# EAGLE schematic bbshd (EAGLE 7.5.0)

## Sheet 1 of 2
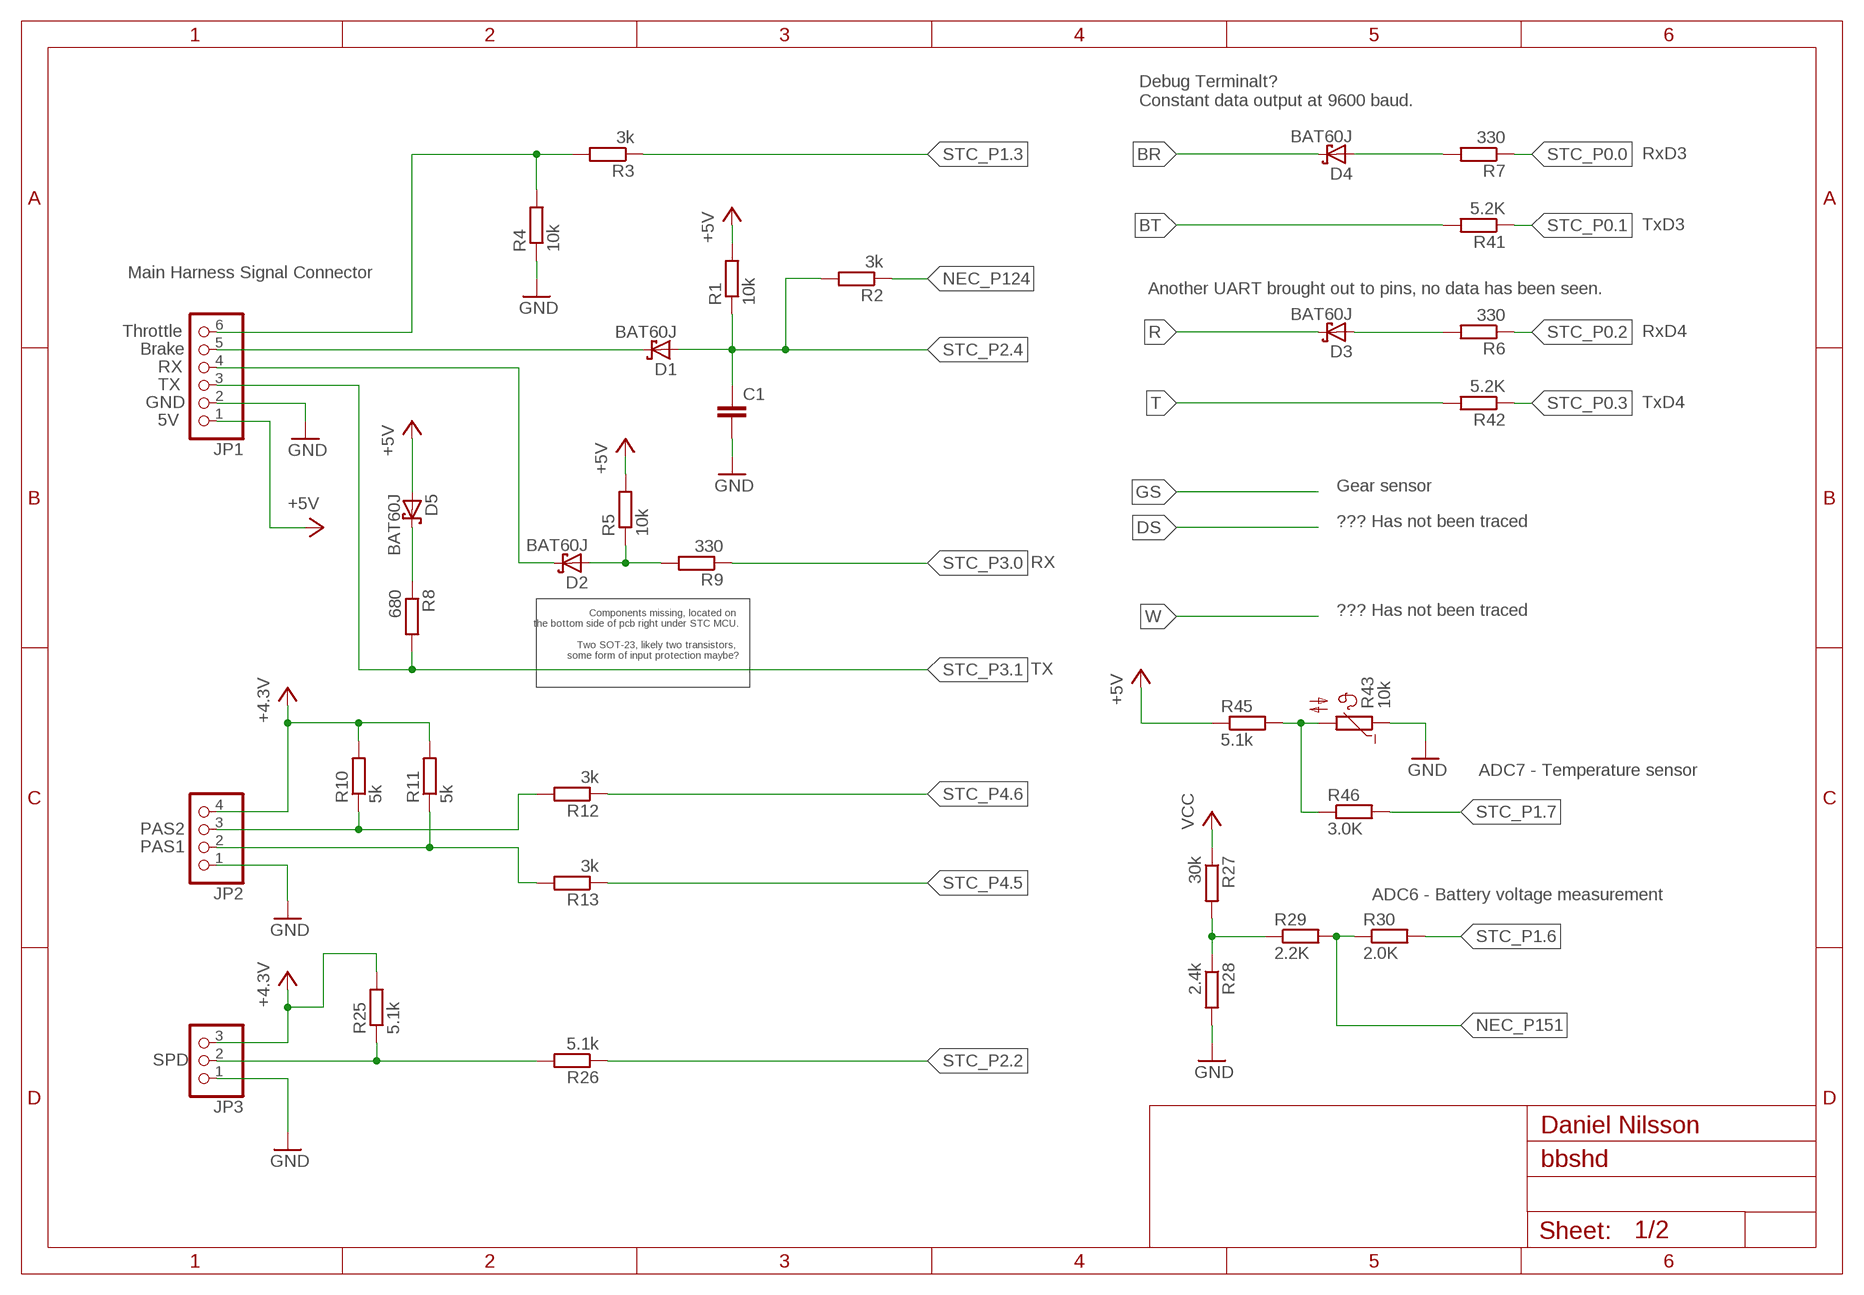
[diagram p0: schematic, sheet 1]

### Parts
C1  C-EUC0603  [C0603]
D1  BAT60J  [SOD323_ST]
D2  BAT60J  [SOD323_ST]
D3  BAT60J  [SOD323_ST]
D4  BAT60J  [SOD323_ST]
D5  BAT60J  [SOD323_ST]
JP1  PINHD-1X6  [1X06]
JP2  PINHD-1X4  [1X04]
JP3  PINHD-1X3  [1X03]
R1  10k  R-EU_R0603  [R0603]
R2  3k  R-EU_R0603  [R0603]
R3  3k  R-EU_R0603  [R0603]
R4  10k  R-EU_R0603  [R0603]
R5  10k  R-EU_R0603  [R0603]
R6  330  R-EU_R0603  [R0603]
R7  330  R-EU_R0603  [R0603]
R8  680  R-EU_R0603  [R0603]
R9  330  R-EU_R0603  [R0603]
R10  5k  R-EU_R0603  [R0603]
R11  5k  R-EU_R0603  [R0603]
R12  3k  R-EU_R0603  [R0603]
R13  3k  R-EU_R0603  [R0603]
R25  5.1k  R-EU_R0603  [R0603]
R26  5.1k  R-EU_R0603  [R0603]
R27  30k  R-EU_R0603  [R0603]
R28  2.4k  R-EU_R0603  [R0603]
R29  2.2K  R-EU_R0603  [R0603]
R30  2.0K  R-EU_R0603  [R0603]
R41  5.2K  R-EU_R0603  [R0603]
R42  5.2K  R-EU_R0603  [R0603]
R43  10k  NTC640  [P640]
R45  5.1k  R-EU_R0603  [R0603]
R46  3.0K  R-EU_R0603  [R0603]

### Nets
+3V3: JP2.4 JP3.3 R10.2 R11.2 R25.2 ; supply symbol labelled +4.3V ; also sheet 2
+5V: D5.A JP1.1 R1.2 R5.2 R45.1 ; also sheet 2
BR: D4.C
BT: R41.2
GND: C1.2 JP1.2 JP2.1 JP3.1 R4.1 R28.2 R43.1 ; also sheet 2
N$1: JP1.6 R3.2 R4.2
N$2: D1.C JP1.5
N$3: D2.C JP1.4
N$4: D2.A R5.1 R9.2
N$5: D3.A R6.2
N$6: D4.A R7.2
N$7: JP2.2 R11.1 R13.2
N$8: D5.C R8.1
N$9: JP2.3 R10.1 R12.2
N$10: JP3.2 R25.1 R26.2
N$14: R27.2 R28.1 R29.1
N$21: R43.2 R45.2 R46.1
NEC_P124: R2.1
NEC_P151: R29.2 R30.1
R: D3.C
STC_P0.0: R7.1
STC_P0.1: R41.1
STC_P0.2: R6.1
STC_P0.3: R42.1
STC_P1.3: R3.1
STC_P1.6: R30.2
STC_P1.7: R46.2
STC_P2.2: R26.1
STC_P2.4: C1.1 D1.A R1.1 R2.2
STC_P3.0: R9.1
STC_P3.1: JP1.3 R8.2
STC_P4.5: R13.1
STC_P4.6: R12.1
T: R42.2
VCC: R27.1

### Notes on the sheet
- Debug Terminalt?
  Constant data output at 9600 baud.
- RxD3
- TxD3
- Main Harness Signal Connector
- Another UART brought out to pins, no data has been seen.
- Throttle | RxD4
- Brake
- RX
- TX
- GND | TxD4
- 5V
- Gear sensor
- ??? Has not been traced
- RX
- Components missing, located on 
  the bottom side of pcb right under STC MCU.
  
  Two SOT-23, likely two transistors, 
  some form of input protection maybe?
- ??? Has not been traced
- TX
- ADC7 - Temperature sensor
- PAS2
- PAS1
- ADC6 - Battery voltage measurement
- SPD
- Daniel Nilsson

## Sheet 2 of 2
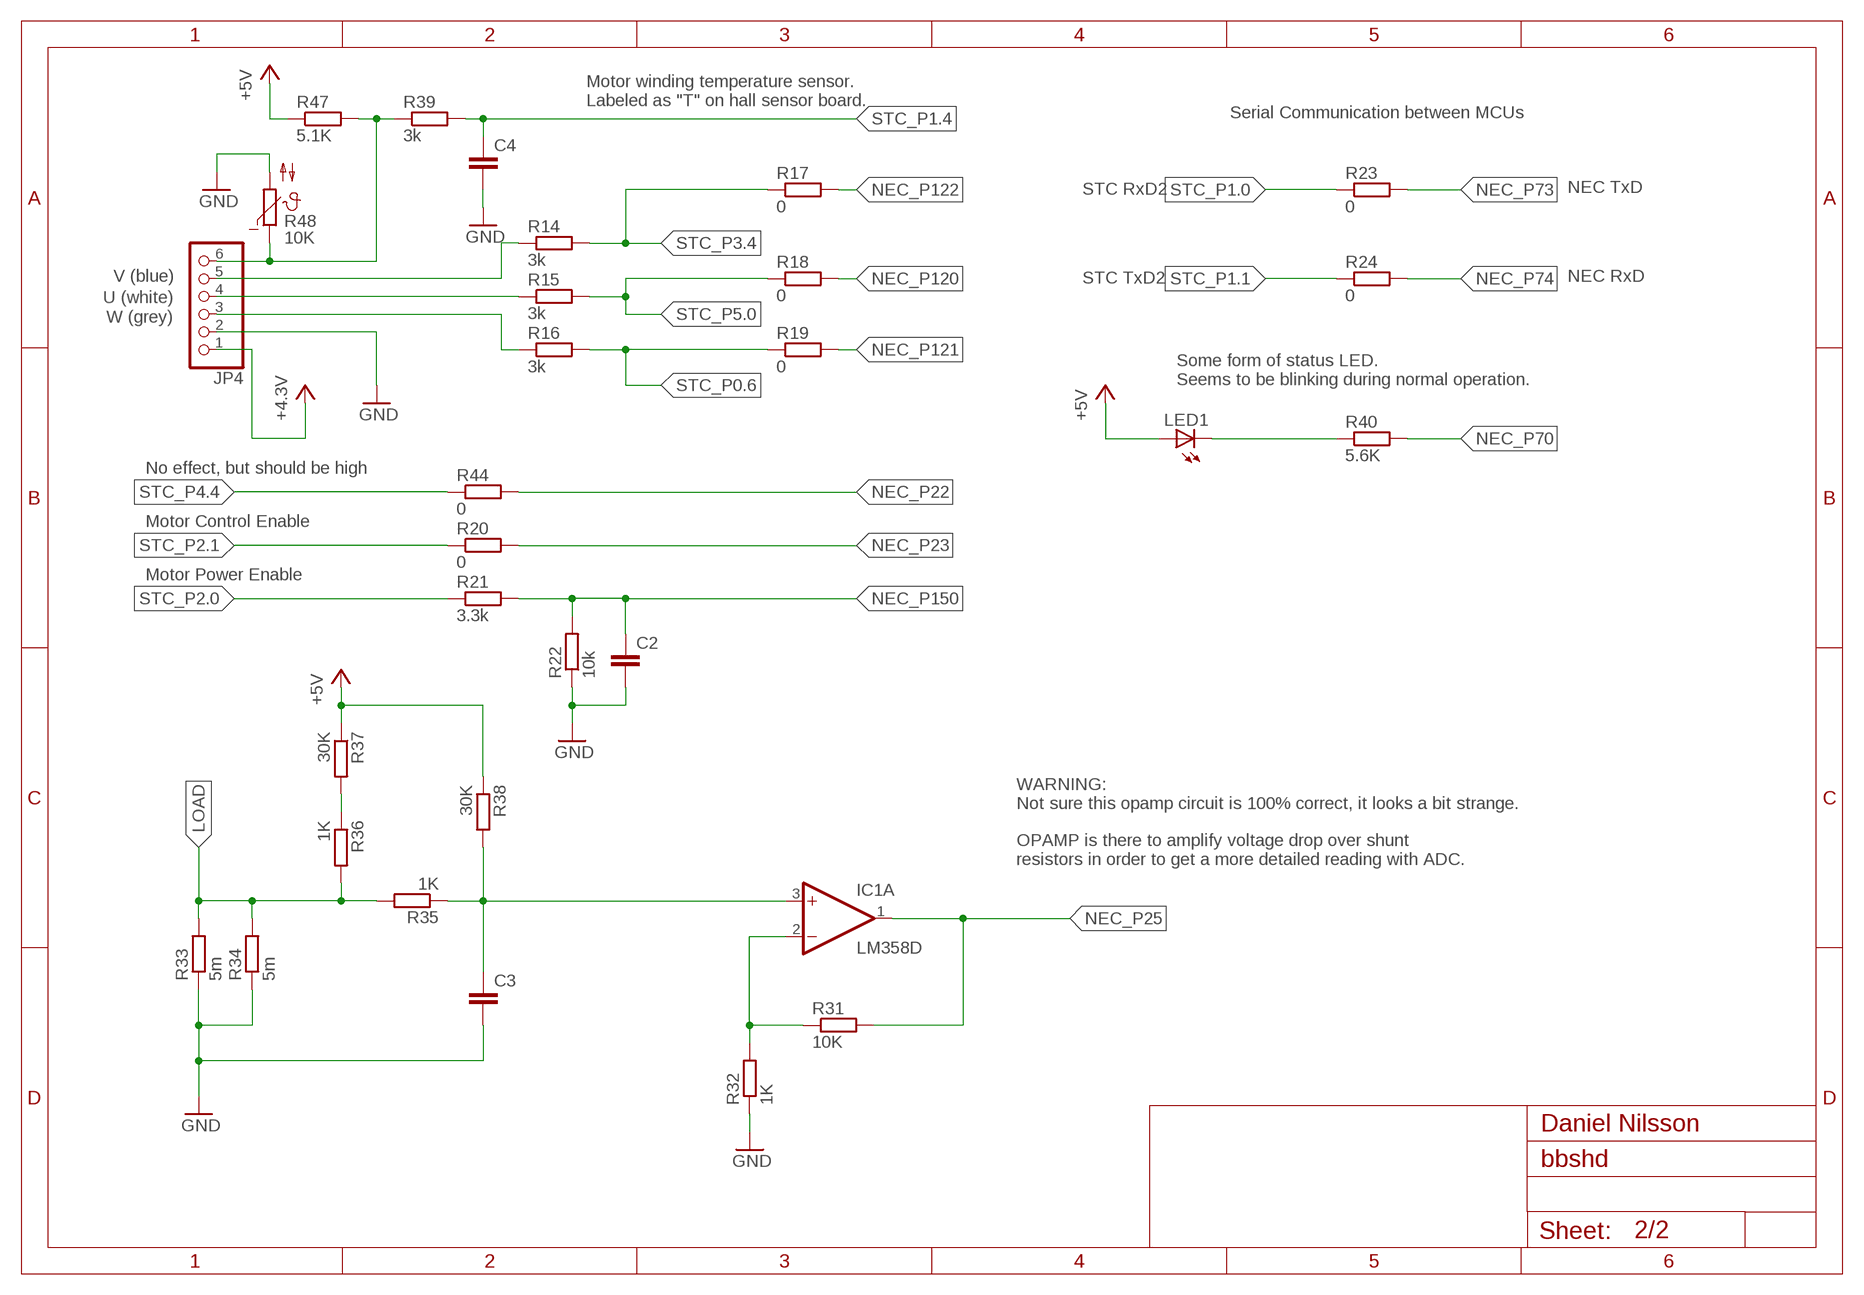
[diagram p1: schematic, sheet 2]

### Parts
C2  C-EUC0603  [C0603]
C3  C-EUC0603  [C0603]
C4  C-EUC0603  [C0603]
IC1  LM358D  [SO08]
JP4  PINHD-1X6  [1X06]
LED1  LED  [SMARTLED-TTW]
R14  3k  R-EU_R0603  [R0603]
R15  3k  R-EU_R0603  [R0603]
R16  3k  R-EU_R0603  [R0603]
R17  0  R-EU_R0603  [R0603]
R18  0  R-EU_R0603  [R0603]
R19  0  R-EU_R0603  [R0603]
R20  0  R-EU_R0603  [R0603]
R21  3.3k  R-EU_R0603  [R0603]
R22  10k  R-EU_R0603  [R0603]
R23  0  R-EU_R0603  [R0603]
R24  0  R-EU_R0603  [R0603]
R31  10K  R-EU_R0603  [R0603]
R32  1K  R-EU_R0603  [R0603]
R33  5m  R-EU_R0603  [R0603]
R34  5m  R-EU_R0603  [R0603]
R35  1K  R-EU_R0603  [R0603]
R36  1K  R-EU_R0603  [R0603]
R37  30K  R-EU_R0603  [R0603]
R38  30K  R-EU_R0603  [R0603]
R39  3k  R-EU_R0603  [R0603]
R40  5.6K  R-EU_R0603  [R0603]
R44  0  R-EU_R0603  [R0603]
R47  5.1K  R-EU_R0603  [R0603]
R48  10K  NTC642-6  [P642]

### Nets
+3V3: JP4.1 ; supply symbol labelled +4.3V ; also sheet 1
+5V: LED1.A@1(A) R37.1 R38.1 R47.1 ; also sheet 1
GND: C2.2 C3.2 C4.2 JP4.2 R22.1 R32.1 R33.1 R34.1 R48.2 ; also sheet 1
LOAD: R33.2 R34.2 R35.2 R36.2
N$11: JP4.3 R16.1
N$12: JP4.4 R15.1
N$13: JP4.5 R14.1
N$16: JP4.6 R39.1 R47.2 R48.1
N$17: IC1.2(A:-IN) R31.1 R32.2
N$18: R36.1 R37.2
N$19: C3.1 IC1.3(A:+IN) R35.1 R38.2
N$20: LED1.C@1(C) R40.1
NEC_P22: R44.2
NEC_P23: R20.2
NEC_P25: IC1.1(A:OUT) R31.2
NEC_P70: R40.2
NEC_P73: R23.2
NEC_P74: R24.2
NEC_P120: R18.2
NEC_P121: R19.2
NEC_P122: R17.2
NEC_P150: C2.1 R21.2 R22.2
STC_P0.6: R16.2 R19.1
STC_P1.0: R23.1
STC_P1.1: R24.1
STC_P1.4: C4.1 R39.2
STC_P2.1: R20.1
STC_P3.4: R14.2 R17.1
STC_P4.4: R44.1
STC_P5.0: R15.2 R18.1
Unconnected: IC1.5(B:+IN) IC1.6(B:-IN) IC1.7(B:OUT) R21.1

### Notes on the sheet
- Motor winding temperature sensor.
  Labeled as "T" on hall sensor board.
- Serial Communication between MCUs
- STC RxD2 | NEC TxD
- V (blue) | STC TxD2 | NEC RxD
- U (white)
- W (grey)
- Some form of status LED.
  Seems to be blinking during normal operation.
- No effect, but should be high
- Motor Control Enable
- Motor Power Enable
- WARNING:
  Not sure this opamp circuit is 100% correct, it looks a bit strange.
  
  OPAMP is there to amplify voltage drop over shunt
  resistors in order to get a more detailed reading with ADC.
- Daniel Nilsson

## Power pins joined to a net without a drawn wire
V+: IC1.8(P:V+)
V-: IC1.4(P:V-)

## Library data of the parts
C1-C4 = rcl:C-EU: CAPACITOR, European symbol
D1-D5 = diode:BAT60J: Schottky barrier diode Source: www.st.com, BAT60J.pdf
IC1 = linear:LM358: OP AMP also LM158; LM258; LM2904 Source: http://cache.national.com/ds/LM/LM158.pdf
JP1 JP4 = pinhead:PINHD-1X6: PIN HEADER
JP2 = pinhead:PINHD-1X4: PIN HEADER
JP3 = pinhead:PINHD-1X3: PIN HEADER
LED1 = led:LED: LED OSRAM: - CHIPLED LG R971, LG N971, LY N971, LG Q971, LY Q971, LO R971, LY R971 LH N974, LH R974 LS Q976, LO Q976, LY Q976 LO Q996 - Hyper CHIPLED LW Q18S LB Q993, LB Q99A, LB R99A - SideLED LS A670, LO A670, LY A670, LG A670, LP A670 LB A673, LV A673, LT A673, LW A673 LH A674 LY A675 LS A676, LA A676, LO A676, LY A676, LW A676 LS A679, LY A679, LG A679 - Hyper Micro SIDELED® LS Y876, LA Y876, LO Y876, LY Y876 LT Y87S - SmartLED LW L88C, LW L88S LB L89C, LB L89S, LG L890 LS L89K, LO L89K, LY L89K LS L896, LA L896, LO L896, LY L896 - TOPLED LS T670, LO T670, LY T670, LG T670, LP T670 LSG T670, LSP T670, LSY T670, LOP T670, LYG T670 LG T671, LOG T671, LSG T671 LB T673, LV T673, LT T673, LW T673 LH T674 LS T676, LA T676, LO T676, LY T676, LB T676, LH T676, LSB T676, LW T676 LB T67C, LV T67C, LT T67C, LS T67K, LO T67K, LY T67K, LW E67C LS E67B, LA E67B, LO E67B, LY E67B, LB E67C, LV E67C, LT E67C LW T67C LS T679, LY T679, LG T679 LS T770, LO T770, LY T770, LG T770, LP T770 LB T773, LV T773, LT T773, LW T773 LH T774 LS E675, LA E675, LY E675, LS T675 LS T776, LA T776, LO T776, LY T776, LB T776 LHGB T686 LT T68C, LB T68C - Hyper Mini TOPLED® LB M676 - Mini TOPLED Santana® LG M470 LS M47K, LO M47K, LY M47K Source: http://www.osram.convergy.de LUXEON: - LUMILED® LXK2-PW12-R00, LXK2-PW12-S00, LXK2-PW14-U00, LXK2-PW14-V00 LXK2-PM12-R00, LXK2-PM12-S00, LXK2-PM14-U00 LXK2-PE12-Q00, LXK2-PE12-R00, LXK2-PE12-S00, LXK2-PE14-T00, LXK2-PE14-U00 LXK2-PB12-K00, LXK2-PB12-L00, LXK2-PB12-M00, LXK2-PB14-N00, LXK2-PB14-P00, LXK2-PB14-Q00 LXK2-PR12-L00, LXK2-PR12-M00, LXK2-PR14-Q00, LXK2-PR14-R00 LXK2-PD12-Q00, LXK2-PD12-R00, LXK2-PD12-S00 LXK2-PH12-R00, LXK2-PH12-S00 LXK2-PL12-P00, LXK2-PL12-Q00, LXK2-PL12-R00 Source: www.luxeon.com KINGBRIGHT: KA-3528ASYC Source: www.kingbright.com
R1-R42 R44-R47 = rcl:R-EU_: RESISTOR, European symbol
R43 = ptc-ntc:NTC640: PHILIPS NTC; OC_FARNELL: unknown; OC_NEWARK: unknown
R48 = ptc-ntc:NTC642-6: PHILIPS NTC; OC_FARNELL: unknown; OC_NEWARK: unknown